# Altium schematic sheet 03_LED.SchDoc
size A4
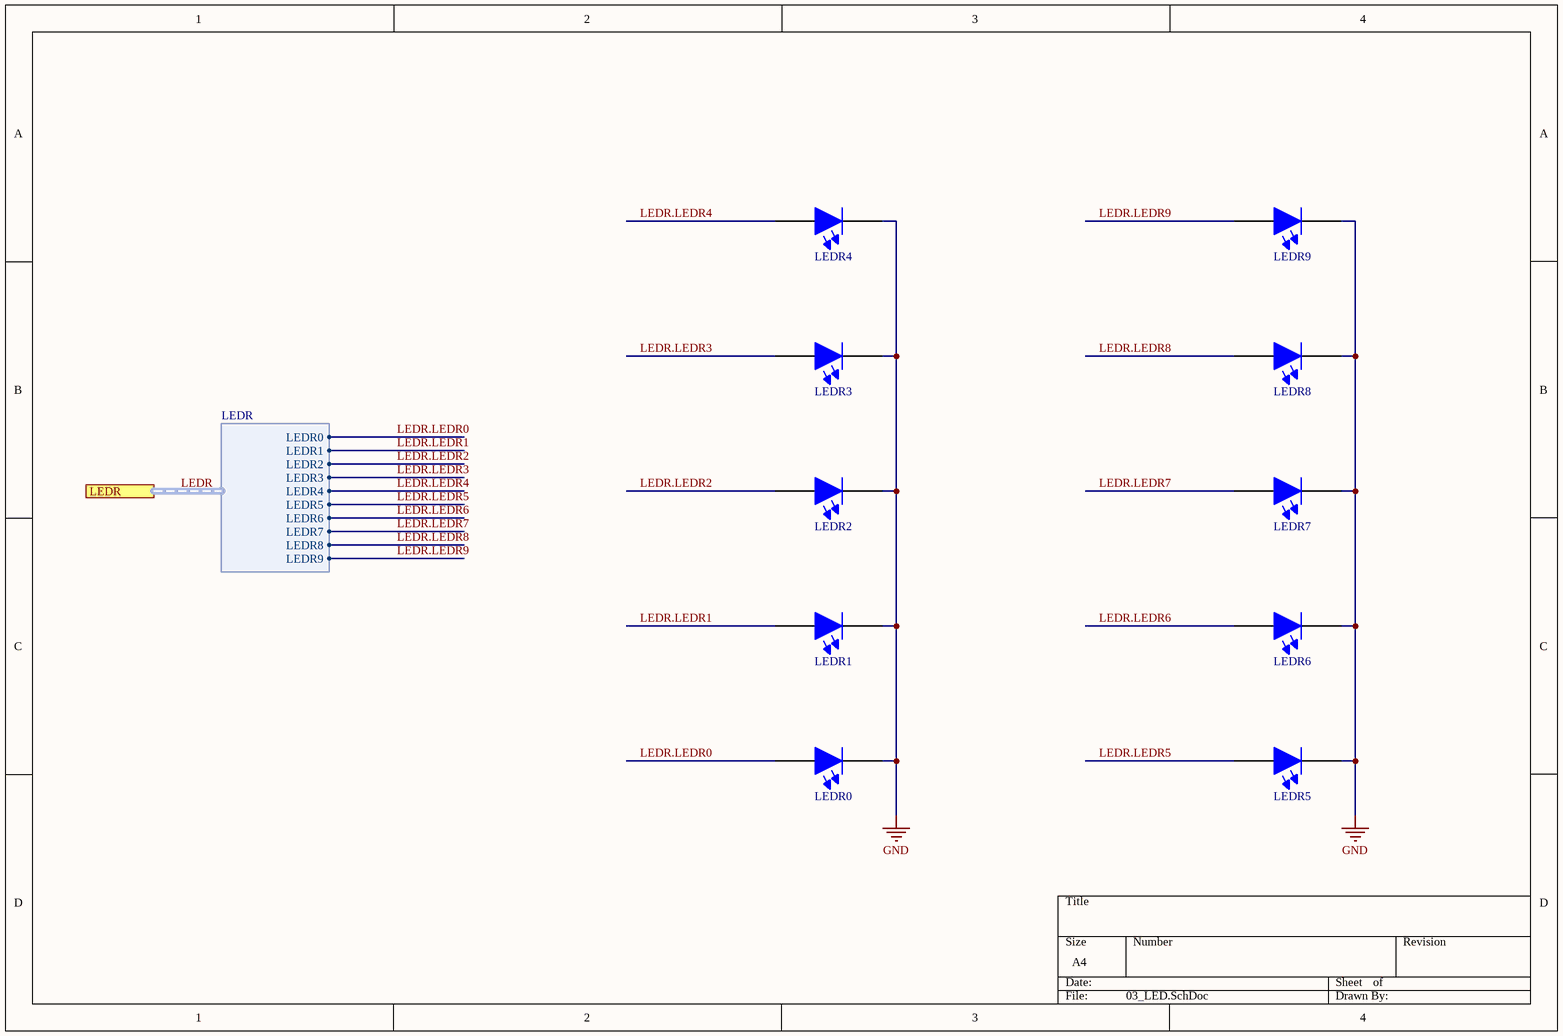
[diagram p0: 03_LED.SchDoc]

## Parts
LEDR0  LED  [0805D-RED]  (value not drawn)
LEDR1  LED  [0805D-RED]  (value not drawn)
LEDR2  LED  [0805D-RED]  (value not drawn)
LEDR3  LED  [0805D-RED]  (value not drawn)
LEDR4  LED  [0805D-RED]  (value not drawn)
LEDR5  LED  [0805D-RED]  (value not drawn)
LEDR6  LED  [0805D-RED]  (value not drawn)
LEDR7  LED  [0805D-RED]  (value not drawn)
LEDR8  LED  [0805D-RED]  (value not drawn)
LEDR9  LED  [0805D-RED]  (value not drawn)

## Ports
LEDR (harness LEDR)

## Harnesses
LEDR: LEDR0, LEDR1, LEDR2, LEDR3, LEDR4, LEDR5, LEDR6, LEDR7, LEDR8, LEDR9

## Nets
GND: LEDR0.K(CATHODE) LEDR1.K(CATHODE) LEDR2.K(CATHODE) LEDR3.K(CATHODE) LEDR4.K(CATHODE) LEDR5.K(CATHODE) LEDR6.K(CATHODE) LEDR7.K(CATHODE) LEDR8.K(CATHODE) LEDR9.K(CATHODE)
LEDR.LEDR0: LEDR0.A(ANODE) ; port LEDR.LEDR0
LEDR.LEDR1: LEDR1.A(ANODE) ; port LEDR.LEDR1
LEDR.LEDR2: LEDR2.A(ANODE) ; port LEDR.LEDR2
LEDR.LEDR3: LEDR3.A(ANODE) ; port LEDR.LEDR3
LEDR.LEDR4: LEDR4.A(ANODE) ; port LEDR.LEDR4
LEDR.LEDR5: LEDR5.A(ANODE) ; port LEDR.LEDR5
LEDR.LEDR6: LEDR6.A(ANODE) ; port LEDR.LEDR6
LEDR.LEDR7: LEDR7.A(ANODE) ; port LEDR.LEDR7
LEDR.LEDR8: LEDR8.A(ANODE) ; port LEDR.LEDR8
LEDR.LEDR9: LEDR9.A(ANODE) ; port LEDR.LEDR9

## Buses and harness runs
harness LEDR = port LEDR

## Library data of the parts
LEDR0-LEDR9 = LED_SMD_Generic: Generic LED; 01 Created By: Thomas Harper; 02 Reviewed By: Rodrigo Maureira @ 2018-04-05; Load: YES; Published: 12-Mar-2018; Publisher: MUEEC; Supplier 1: Digi-Key; Supplier Part Number 1: 732-4984-1-ND; Mount: SMD